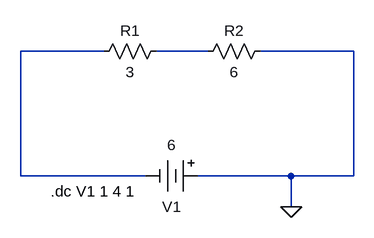
[diagram p0: schematic Assignment 1 series.asc]
Assignment 1 series.asc, the LTspice schematic file:
Version 4
SHEET 1 880 680
WIRE -80 64 -208 64
WIRE 80 64 0 64
WIRE 304 64 160 64
WIRE -208 256 -208 64
WIRE -16 256 -208 256
WIRE 208 256 64 256
WIRE 304 256 304 64
WIRE 304 256 208 256
WIRE 208 304 208 256
FLAG 208 304 0
SYMBOL res -96 80 R270
WINDOW 0 32 56 VTop 2
WINDOW 3 0 56 VBottom 2
SYMATTR InstName R1
SYMATTR Value 3
SYMBOL res 64 80 R270
WINDOW 0 32 56 VTop 2
WINDOW 3 0 56 VBottom 2
SYMATTR InstName R2
SYMATTR Value 6
SYMBOL Misc\\battery 80 256 R90
WINDOW 0 32 56 VTop 2
WINDOW 3 -32 56 VBottom 2
WINDOW 123 0 0 Left 0
WINDOW 39 0 0 Left 0
SYMATTR InstName V1
SYMATTR Value 6
TEXT -162 280 Left 2 !.dc V1 1 4 1

The netlist it stands for:
* Assignment 1 series.asc
R1 N001 N002 3
R2 N002 0 6
V1 0 N001 6
.dc V1 1 4 1
.backanno
.end